# Altium schematic sheet LED_Driver.SchDoc
size A; SheetNumber: 5; SheetTotal: 5
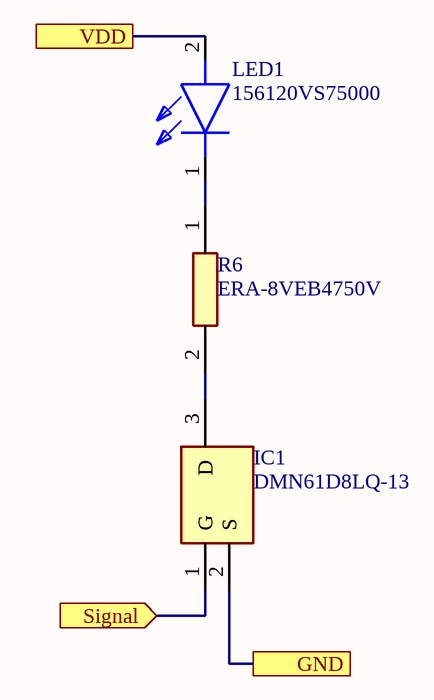
[diagram p0: LED_Driver.SchDoc]

## Parts
IC1  DMN61D8LQ-13  [SOT96P240X110-3N]
LED1  156120VS75000  [156120VS75000]
R6  ERA-8VEB4750V  [ERA8KEB1004V]

## Ports
GND, Signal (in), VDD

## Nets
GND: IC1.2(S) ; port GND
Signal: IC1.1(G) ; port Signal
VDD: LED1.2(A) ; port VDD
NetIC1_3: IC1.3(D) R6.2
NetLED1_1: LED1.1(K) R6.1

## Library data of the parts
IC1 = DMN61D8LQ-13: Integrated Circuit; Manufacturer_Name: Diodes Incorporated; Datasheet Link: https://www.diodes.com//assets/Datasheets/DMN61D8LQ.pdf; Height: 1.1mm; Manufacturer_Part_Number: DMN61D8LQ-13; Mouser Part Number: 621-DMN61D8LQ-13; Mouser Price/Stock: https://www.mouser.co.uk/ProductDetail/Diodes-Incorporated/DMN61D8LQ-13?qs=DBvH5xl4UymJgoulTjiNCg%3D%3D; Arrow Part Number: DMN61D8LQ-13; Arrow Price/Stock: https://www.arrow.com/en/products/dmn61d8lq-13/diodes-incorporated?utm_currency=USD&region=nac
LED1 = 156120VS75000: LED; Manufacturer_Name: Wurth Elektronik; Datasheet Link: https://www.we-online.com/components/products/datasheet/156120VS75000.pdf; Height: 1.3mm; Manufacturer_Part_Number: 156120VS75000; Mouser Part Number: 710-156120VS75000; Mouser Price/Stock: https://www.mouser.co.uk/ProductDetail/Wurth-Elektronik/156120VS75000?qs=2kOmHSv6VfQAUFg5BeuEfQ%3D%3D
R6 = ERA-8VEB4750V: 475 ohm resistor; Manufacturer_Name: Panasonic; Datasheet Link: https://industrial.panasonic.com/cdbs/www-data/pdf/RDM0000/RDM0000C331.pdf; Height: 0.65mm; Manufacturer_Part_Number: ERA-8VEB4750V; Mouser Part Number: 667-ERA-8VEB4750V; Mouser Price/Stock: https://www.mouser.co.uk/ProductDetail/Panasonic/ERA-8VEB4750V?qs=By6Nw2ByBD36LBLC0KPpEw%3D%3D